# EAGLE design Chess_Clock_Larger (EAGLE 6.5.0)
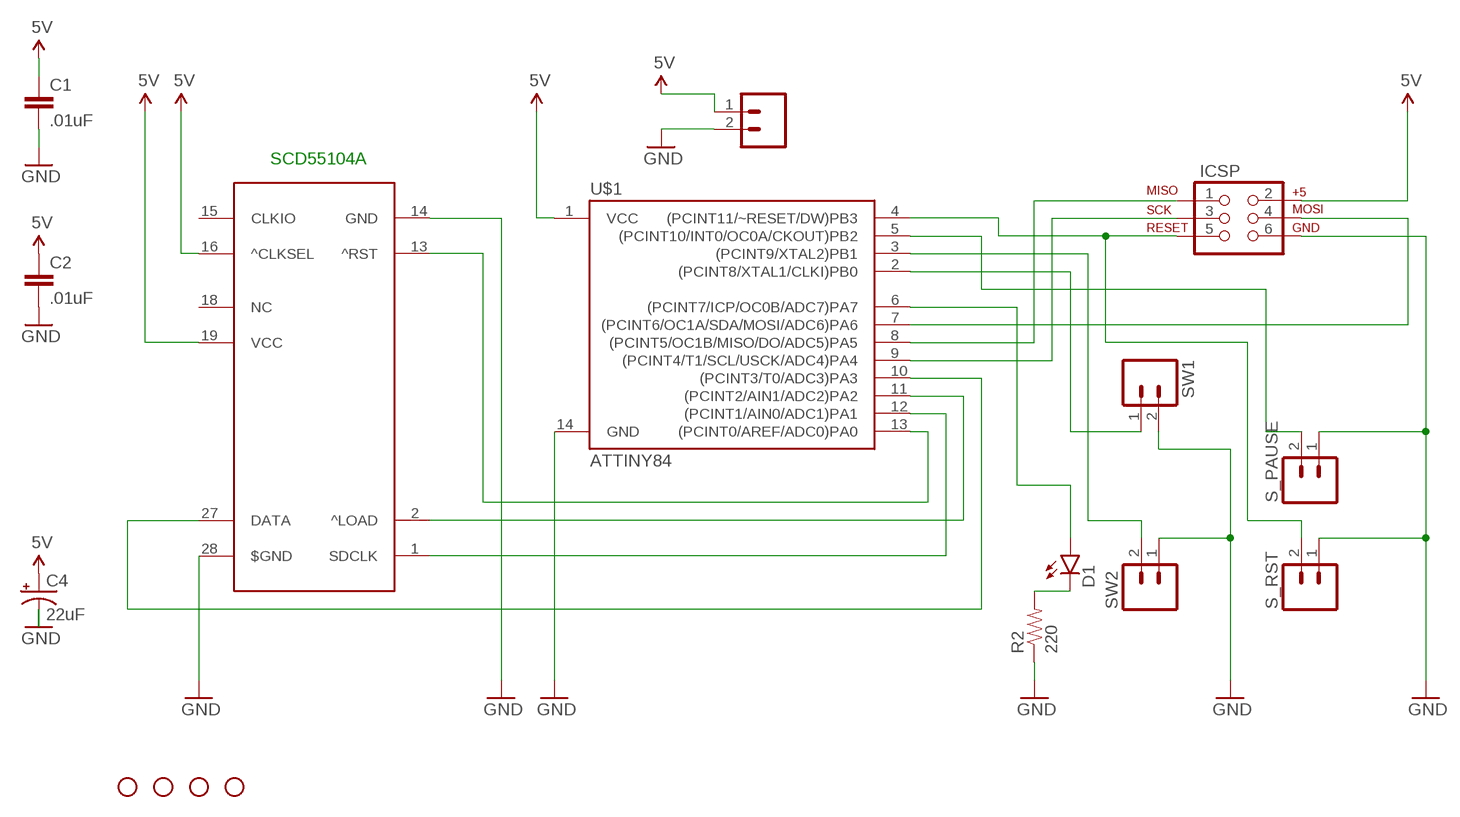
[diagram p0: schematic, sheet 1]

## Parts
C1  .01uF  CAPPTH  [CAP-PTH-SMALL]
C2  .01uF  CAPPTH  [CAP-PTH-SMALL]
C4  22uF  CAP_POLPTH2  [CPOL-RADIAL-10UF-25V]
D1  LED5MM  [LED5MM]
ICSP  AVR_SPI_PRG_6PTH  [2X3]
R2  220  RESISTOR1206  [1206]
S_PAUSE  M02PTH  [1X02]
S_RST  M02PTH  [1X02]
SCD55104A  SCD_55104A  [SCD55104A]
STANDOFF1  STAND-OFF  [STAND-OFF]
STANDOFF2  STAND-OFF  [STAND-OFF]
STANDOFF3  STAND-OFF  [STAND-OFF]
STANDOFF4  STAND-OFF  [STAND-OFF]
SW1  M02PTH  [1X02]
SW2  M02PTH  [1X02]
SW3  M02PTH  [1X02]
U$1  ATTINY84  [SO14]

## Nets
5V: C1.1 C2.1 C4.1(+) ICSP.2 SCD55104A.16(^CLKSEL) SCD55104A.19(VCC) SW3.1 U$1.1(VCC)
GND: C1.2 C2.2 C4.2(-) ICSP.6 R2.1 S_PAUSE.1 S_RST.1 SCD55104A.14(GND) SCD55104A.28($GND) SW1.2 SW2.1 SW3.2 U$1.14(GND)
N$1: D1.K(C) R2.2
N$2: SCD55104A.13(^RST) U$1.13((PCINT0/AREF/ADC0)PA0)
N$3: ICSP.4 U$1.7((PCINT6/OC1A/SDA/MOSI/ADC6)PA6)
N$4: ICSP.5 S_RST.2 U$1.4((PCINT11/~RESET/DW)PB3)
N$5: ICSP.1 U$1.8((PCINT5/OC1B/MISO/DO/ADC5)PA5)
N$6: ICSP.3 U$1.9((PCINT4/T1/SCL/USCK/ADC4)PA4)
N$7: SCD55104A.1(SDCLK) U$1.12((PCINT1/AIN0/ADC1)PA1)
N$8: SCD55104A.2(^LOAD) U$1.11((PCINT2/AIN1/ADC2)PA2)
N$9: SW1.1 U$1.2((PCINT8/XTAL1/CLKI)PB0)
N$10: SW2.2 U$1.3((PCINT9/XTAL2)PB1)
N$12: S_PAUSE.2 U$1.5((PCINT10/INT0/OC0A/CKOUT)PB2)
N$13: D1.A U$1.6((PCINT7/ICP/OC0B/ADC7)PA7)
N$14: SCD55104A.27(DATA) U$1.10((PCINT3/T0/ADC3)PA3)
Unconnected: SCD55104A.15(CLKIO) SCD55104A.18(NC)

## Notes on the sheet
- SCD55104A

## Library data of the parts
C1 C2 = SparkFun-Passives:CAP: Capacitor Standard 0603 ceramic capacitor, and 0.1" leaded capacitor.
C4 = SparkFun-Passives:CAP_POL: Capacitor Polarized These are standard SMD and PTH capacitors. Normally 10uF, 47uF, and 100uF in electrolytic and tantalum varieties. Always verify the external diameter of the through hole cap, it varies with capacity, voltage, and manufacturer. The EIA devices should be standard.
D1 = SparkFun-LED:LED: LEDs Standard schematic elements and footprints for 5mm, 3mm, 1206, and 0603 sized LEDs. 5mm - Spark Fun Electronics SKU : COM-00529 (and others)
ICSP = SparkFun-Connectors:AVR_SPI_PRG_6: AVR ISP 6 Pin This is the reduced ISP connector for AVR programming. Common on Arduino. This footprint will take up less PCB space and can be used with a 10-pin to 6-pin adapter such as SKU: BOB-08508
R2 = SparkFun-Passives:RESISTOR: Resistor Basic schematic elements and footprints for 0603, 1206, and PTH resistors.
S_PAUSE S_RST SW1-SW3 = SparkFun-Connectors:M02: Standard 2-pin 0.1" header. Use with - straight break away headers ( PRT-00116) - right angle break away headers (PRT-00553) - swiss pins (PRT-00743) - machine pins (PRT-00117) - female headers (PRT-00115) Molex polarized connector foot print use with: PRT-08233 with associated crimp pins and housings. 2.54_SCREWTERM for use with PRT-10571. 3.5mm Screw Terminal footprints for PRT-08084 5mm Screw Terminal footprints for use with PRT-08433
SCD55104A = DL1416_Library:SCD_55104A
STANDOFF1-STANDOFF4 = SparkFun-Electromechanical:STAND-OFF: #4 Stand Off This is the mechanical footprint for a #4 phillips button head screw. Use the keepout ring to avoid running the screw head into surrounding components. SKU : PRT-00447
U$1 = SparkFun-DigitalIC:ATTINY84: Atmel 14-pin 2/4/8kB flash uC

## Board
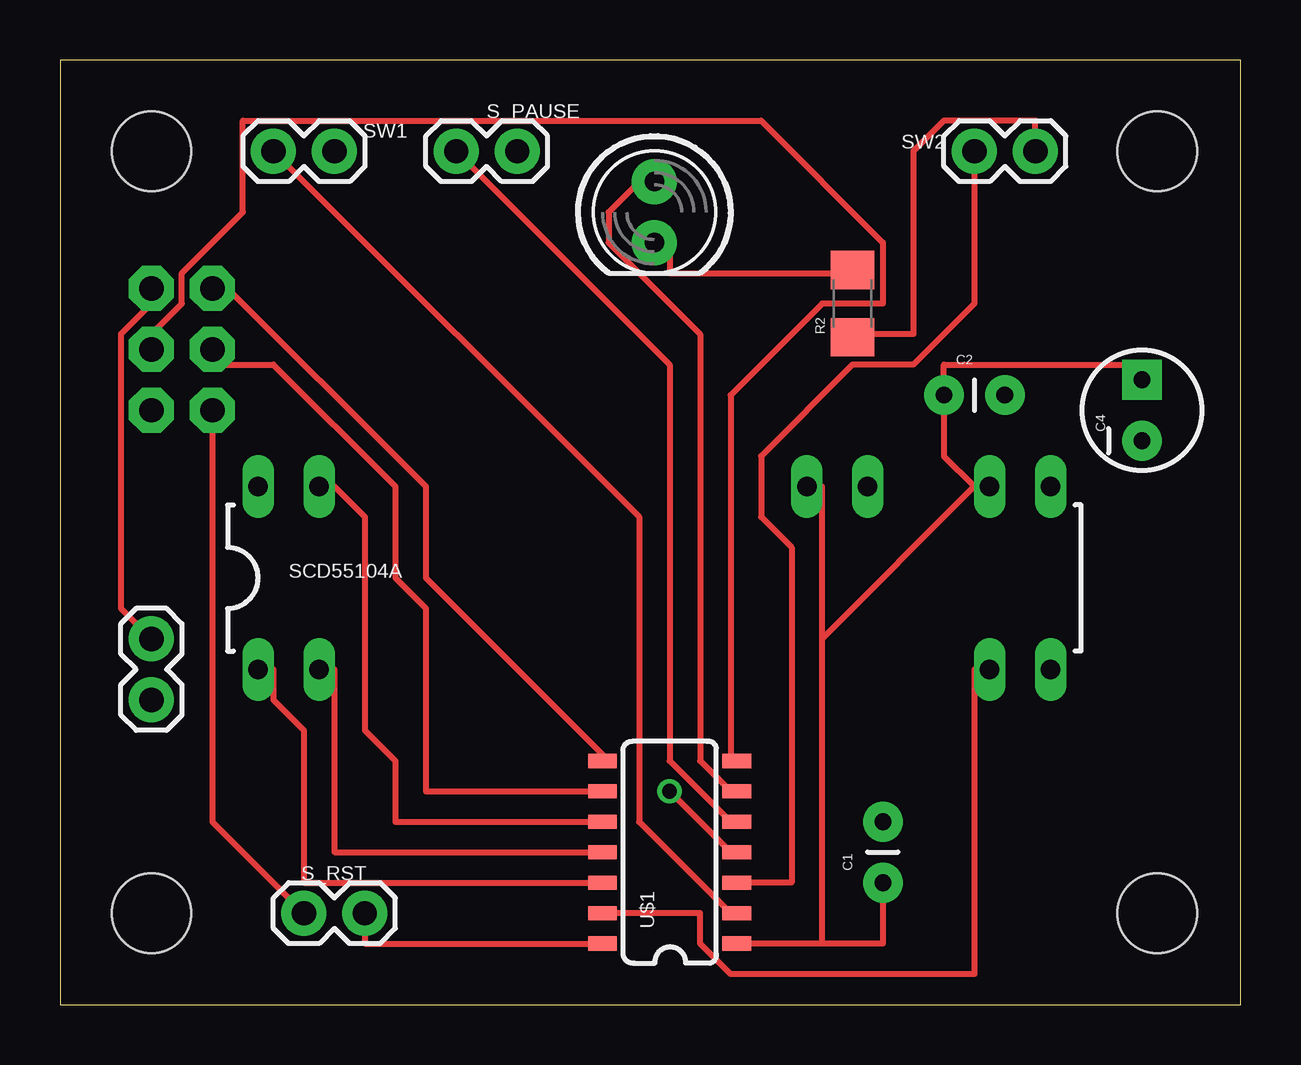
[diagram p1: board, top side]
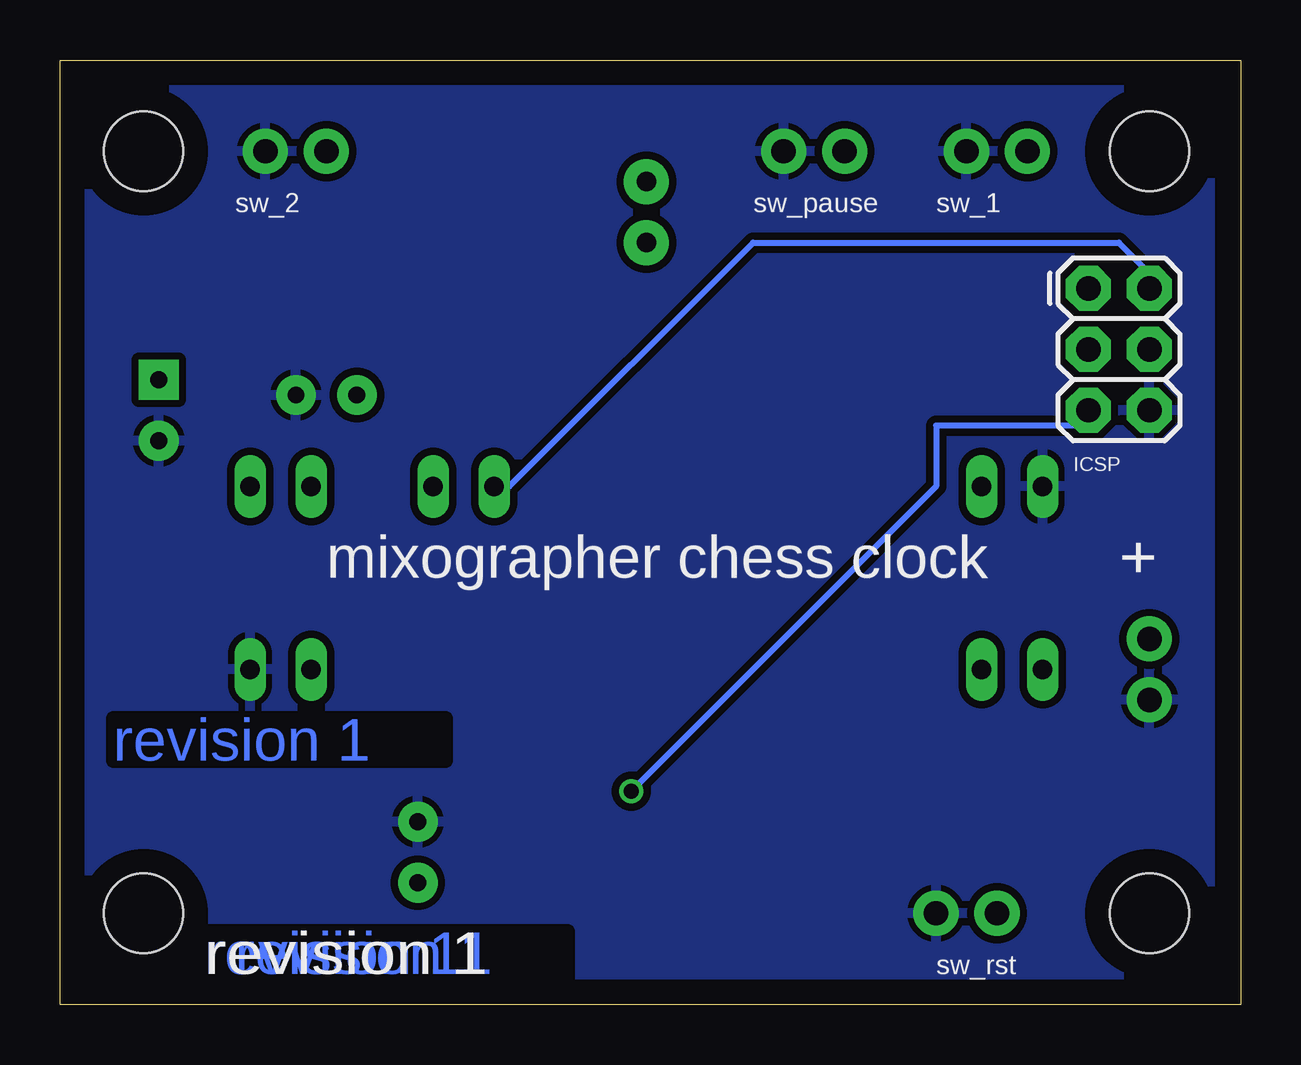
[diagram p2: board, bottom side, seen from below]

Size 49.2 x 39.36 mm. Coordinates in mm from the lower left corner, seen from the top.
Outline: 0,0 49.2,0 49.2,39.36 0,39.36 0,0
Copper layers (1*16): Top 0.035mm / dielectric 1.5mm / Bottom 0.035mm
Design rules "default": minimum track width 10mil, minimum drill 24mil, track to track 8mil, track to pad 8mil, pad to pad 8mil, via to via 8mil, smd to smd 8mil, copper to edge 40mil, drill to drill 8mil, minimum pad ring 10mil, minimum via ring 8mil, stop-mask expansion 4mil, vias tented up to drill 0mil, thermal gap 10mil

### Footprints (pad centres in the part's own frame; a part is rotated, then mirrored left to right if it is on the bottom)
CAP-PTH-SMALL = drill 0.7 pad 1.651: 1 0,0; 2 2.54,0
CPOL-RADIAL-10UF-25V = drill 0.7 pad 1.651 square: 1 1.27,0 | drill 0.7 pad 1.651: 2 -1.27,0
LED5MM = drill 0.813 pad 1.88: A -1.27,0; K 1.27,0
2X3 = drill 1.016 pad 1.88 octagon: 1 0,0; 2 0,2.54; 3 2.54,0; 4 2.54,2.54; 5 5.08,0; 6 5.08,2.54
1206 = smd 1.6 x 1.8: 1 -1.4,0; 2 1.4,0
1X02 = drill 1.016 pad 1.88: 1 0,0; 2 2.54,0
SCD55104A = drill 0.813 long: 1 -16.51,-3.81; 2 -13.97,-3.81; 13 13.97,-3.81; 14 16.51,-3.81; 15 16.51,3.81; 16 13.97,3.81; 18 8.89,3.81; 19 6.35,3.81; 27 -13.97,3.81; 28 -16.51,3.81
STAND-OFF = hole 3.302: 0,0
SO14 = smd 0.6 x 1.2: 1 -3.81,-2.8; 2 -2.54,-2.8; 3 -1.27,-2.8; 4 0,-2.8; 5 1.27,-2.8; 6 2.54,-2.8; 7 3.81,-2.8; 8 3.81,2.8; 9 2.54,2.8; 10 1.27,2.8; 11 0,2.8; 12 -1.27,2.8; 13 -2.54,2.8; 14 -3.81,2.8

### Placement (x,y rotation side)
C1  34.29,5.08 90 top
C2  36.83,25.4 0 top
C4  45.09,24.77 90 top
D1  24.77,33.02 270 top
ICSP  6.35,29.84 270 bottom
R2  33.02,29.21 90 top
S_PAUSE  19.05,35.56 180 top
S_RST  12.7,3.81 180 top
SCD55104A  24.77,17.78 0 top
STANDOFF1  3.81,35.56 0 top
STANDOFF2  45.72,35.56 0 top
STANDOFF3  45.72,3.81 0 top
STANDOFF4  3.81,3.81 0 top
SW1  8.89,35.56 0 top
SW2  40.64,35.56 180 top
SW3  3.81,15.24 270 top
U$1  25.4,6.35 90 top

### Tracks (layer width: path | path; a pad name or v marks a point on that pad's centre or on a via)
5V
  Top 0.254: SW3.1 2.54,16.51 2.54,27.94 3.81,29.21 ICSP.2 | 38.1,21.59 36.83,22.86 C2.1 36.83,26.67 44.45,26.67 C4.1 | 31.75,2.54 34.29,2.54 C1.1 | 31.75,2.54 U$1.1 27.94,2.54 | 31.75,2.54 31.75,15.24 | 31.75,15.24 31.75,21.59 SCD55104A.19 | 31.75,15.24 38.1,21.59 | 38.1,21.59 SCD55104A.16
  Bottom 0.254: ICSP.2 3.81,30.48 5.08,31.75 20.32,31.75 30.48,21.59 SCD55104A.19
GND
  Top 0.254: S_RST.1 12.7,2.54 U$1.14 22.86,2.54 | SW2.1 40.64,36.83 36.83,36.83 35.56,35.56 35.56,27.94 33.02,27.94 R2.1
  pour Bottom (isolate 0.305): 1.27,38.1 48.26,38.1 48.26,1.27 1.27,1.27
N$1
  Top 0.254: R2.2 33.02,30.48 25.4,30.48 25.4,31.75 D1.K
N$2
  Top 0.254: U$1.13 26.67,3.81 26.67,2.54 27.94,1.27 38.1,1.27 38.1,13.97 SCD55104A.13
N$3
  Top 0.254: U$1.7 27.94,10.16 27.94,25.4 31.75,29.21 34.29,29.21 34.29,31.75 29.21,36.83 7.62,36.83 7.62,33.02 5.08,30.48 5.08,29.21 3.81,27.94 ICSP.4
N$4  (via drill 0.61)
  Top 0.254: v25.4,8.89 27.94,6.35 U$1.4 | S_RST.2 6.35,7.62 ICSP.5
  Bottom 0.254: v25.4,8.89 12.7,21.59 12.7,24.13 6.35,24.13 ICSP.5
N$5
  Top 0.254: U$1.8 22.86,10.16 15.24,17.78 15.24,21.59 6.35,30.48 ICSP.1
N$6
  Top 0.254: 22.86,8.89 U$1.9 15.24,8.89 15.24,16.51 13.97,17.78 13.97,21.59 8.89,26.67 6.35,26.67 ICSP.3
N$7
  Top 0.254: 22.86,5.08 U$1.12 10.16,5.08 10.16,11.43 8.89,12.7 8.89,13.97 SCD55104A.1
N$8
  Top 0.254: 22.86,6.35 U$1.11 11.43,6.35 11.43,13.97 SCD55104A.2
N$9
  Top 0.254: SW1.1 24.13,20.32 24.13,7.62 27.94,3.81 U$1.2
N$10
  Top 0.254: SW2.2 38.1,29.21 35.56,26.67 33.02,26.67 29.21,22.86 29.21,20.32 30.48,19.05 30.48,5.08 U$1.3 27.94,5.08
N$12
  Top 0.254: S_PAUSE.2 25.4,26.67 25.4,10.16 27.94,7.62 U$1.5
N$13
  Top 0.254: U$1.6 27.94,8.89 26.67,10.16 26.67,27.94 22.86,31.75 22.86,33.02 24.13,34.29 D1.A
N$14
  Top 0.254: 22.86,7.62 U$1.10 13.97,7.62 13.97,10.16 12.7,11.43 12.7,20.32 11.43,21.59 SCD55104A.27

### Text on the board
Bottom: revision 1 | revision 1 | revision 1 | revision 1
bNames: sw_1 | sw_pause | sw_2 | + | mixographer chess clock | sw_rst | revision 1